# EAGLE design 2_RS485_RS422 (EAGLE 7.6.0)
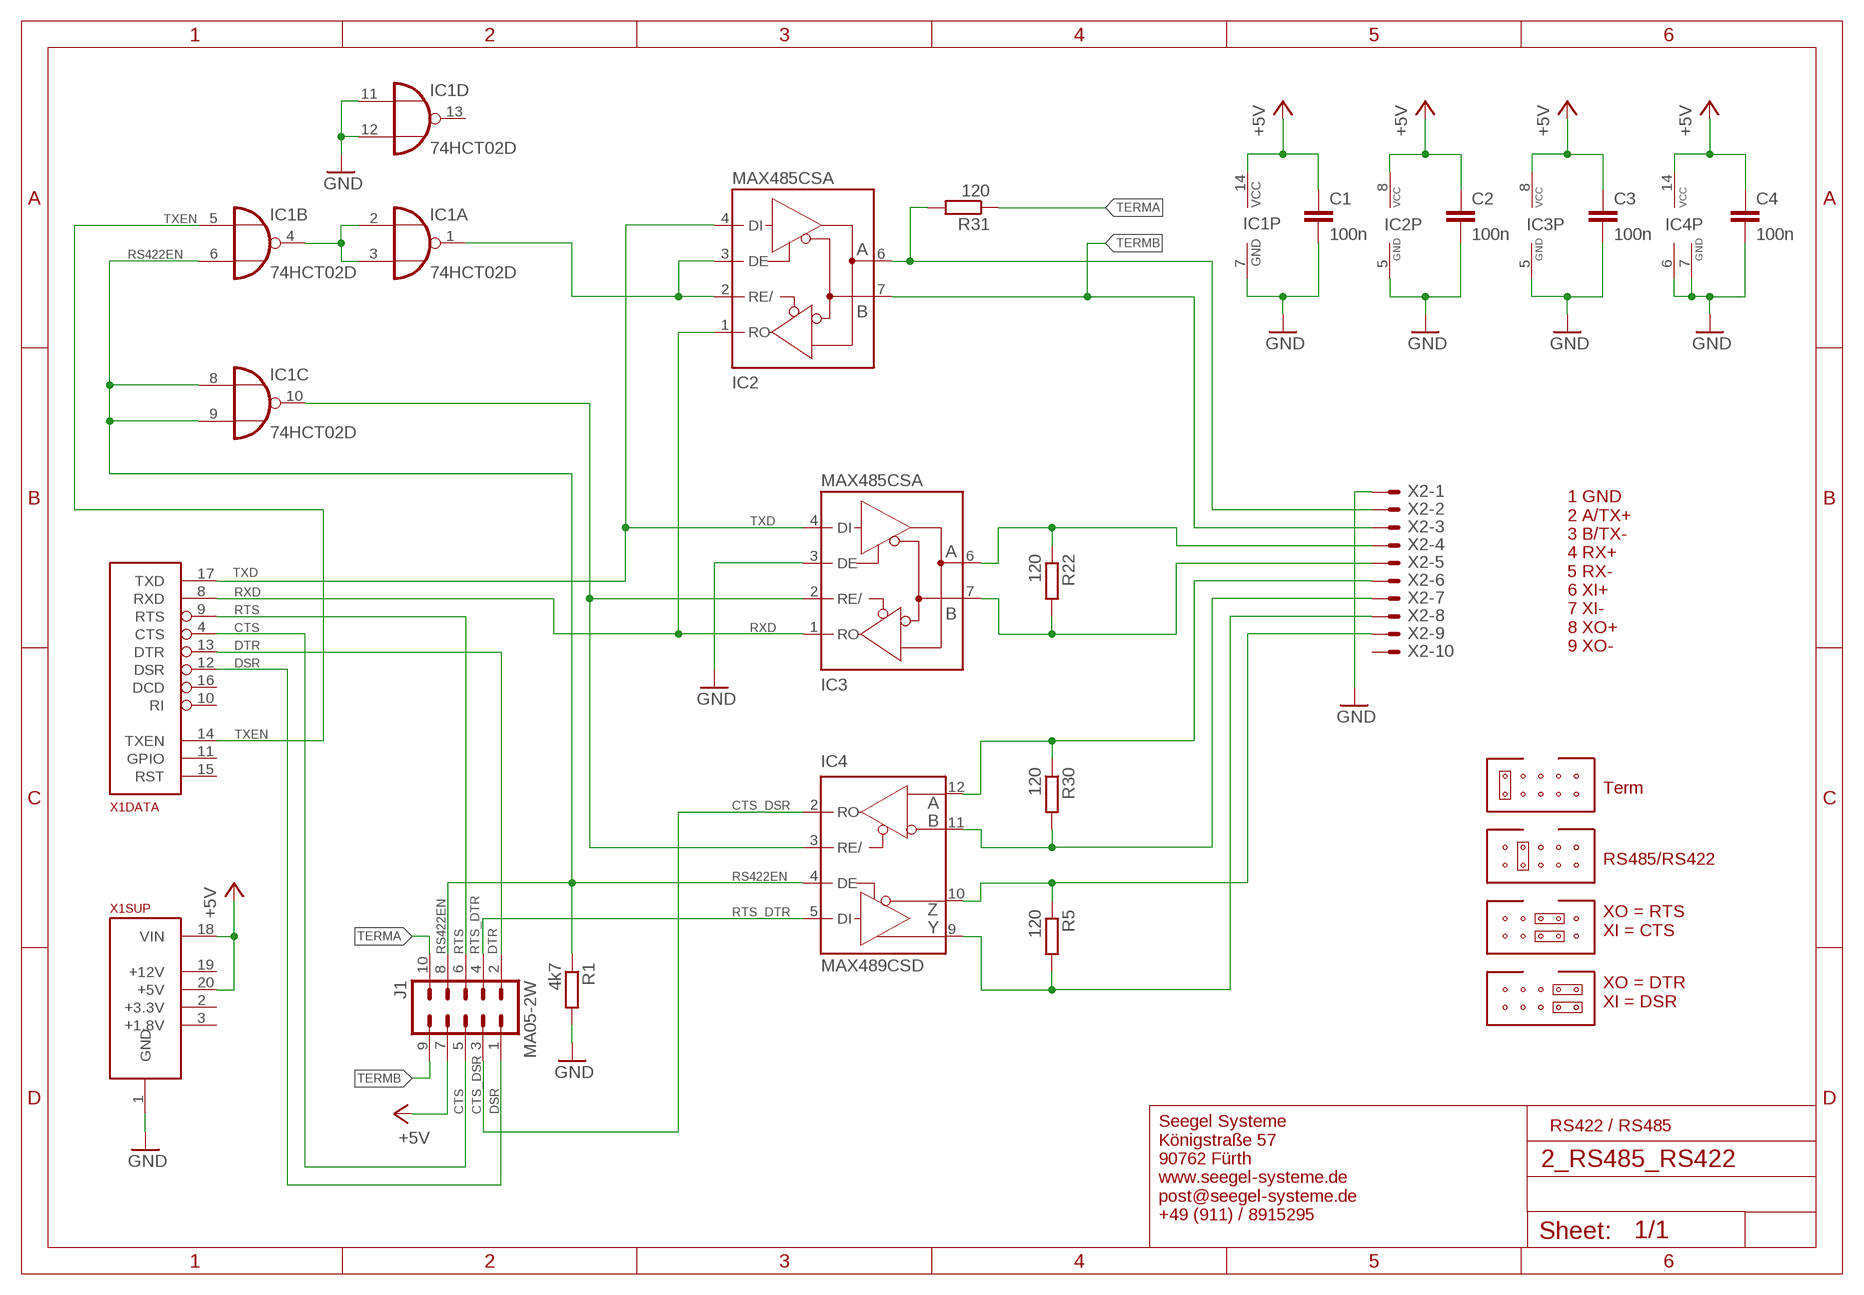
[diagram p0: schematic, sheet 1]

## Parts
C1  100n  C-EUC0805  [C0805]
C2  100n  C-EUC0805  [C0805]
C3  100n  C-EUC0805  [C0805]
C4  100n  C-EUC0805  [C0805]
IC1  74HCT02D  [SO14]
IC2  MAX485CSA  MAX481CSA  [SO08]
IC3  MAX485CSA  MAX481CSA  [SO08]
IC4  MAX489CSD  [SO14]
J1  MA05-2W  [MA05-2W]
R1  4k7  R-EU_R0805  [R0805]
R5  120  R-EU_R0805  [R0805]
R22  120  R-EU_R0805  [R0805]
R30  120  R-EU_R0805  [R0805]
R31  120  R-EU_R0805  [R0805]
X1  ALLSERIALSLAVE  [DAUGHTER-THT]
X2  AKL18X-10W  [AKL182-10]

## Nets
+5V: C1.1 C2.1 C3.1 C4.1 IC1.14(P:VCC) IC2.8(VCC) IC3.8(VCC) IC4.14(VCC) J1.7 X1.18(SUP:VIN) X1.20(SUP:+5V)
CTS: J1.5 X1.4(DATA:CTS)
CTS_DSR: IC4.2(RO) J1.3
DSR: J1.1 X1.12(DATA:DSR)
DTR: J1.2 X1.13(DATA:DTR)
GND: C1.2 C2.2 C3.2 C4.2 IC1.7(P:GND) IC1.11(D:I0) IC1.12(D:I1) IC2.5(GND) IC3.3(DE) IC3.5(GND) IC4.6(GND) IC4.7(GND) R1.2 X1.1(SUP:GND) X2.P$1
N$1: IC4.11(B) R30.2 X2.P$7
N$2: IC4.10(Z) R5.1 X2.P$9
N$3: IC2.6(A) R31.2 X2.P$2
N$10: IC4.9(Y) R5.2 X2.P$8
N$39: IC4.12(A) R30.1 X2.P$6
N$41: IC3.7(B) R22.2 X2.P$5
N$43: IC3.6(A) R22.1 X2.P$4
N$48: IC1.2(A:I0) IC1.3(A:I1) IC1.4(B:O)
N$50: IC1.1(A:O) IC2.2(RE/) IC2.3(DE)
N$51: IC1.10(C:O) IC3.2(RE/) IC4.3(RE/)
RS422EN: IC1.6(B:I1) IC1.8(C:I0) IC1.9(C:I1) IC4.4(DE) J1.8 R1.1
RTS: J1.6 X1.9(DATA:RTS)
RTS_DTR: IC4.5(DI) J1.4
RXD: IC2.1(RO) IC3.1(RO) X1.8(DATA:RXD)
TERMA: J1.10 R31.1
TERMB: IC2.7(B) J1.9 X2.P$3
TXD: IC2.4(DI) IC3.4(DI) X1.17(DATA:TXD)
TXEN: IC1.5(B:I0) X1.14(DATA:TXEN)
Unconnected: IC1.13(D:O) IC4.1(NC) IC4.8(NC) IC4.13(NC) X1.2(SUP:+3.3V) X1.3(SUP:+1.8V) X1.5(USB:D-) X1.6(USB:D+) X1.7(USB:VUSB) X1.10(DATA:RI) X1.11(DATA:GPIO) X1.15(DATA:RST) X1.16(DATA:DCD) X1.19(SUP:+12V) X2.P$10

## Notes on the sheet
- 1 GND
  2 A/TX+
  3 B/TX-
  4 RX+
  5 RX-
  6 XI+
  7 XI-
  8 XO+
  9 XO-
- Term
- RS485/RS422
- XO = RTS
  XI = CTS
- XO = DTR
  XI = DSR
- RS422 / RS485
- Seegel Systeme
  Königstraße 57
  90762 Fürth
  www.seegel-systeme.de
  post@seegel-systeme.de
  +49 (911) / 8915295

## Library data of the parts
C1-C4 = rcl:C-EU: CAPACITOR, European symbol
IC1 = 74xx-eu:74*02: Quad 2-input NOR gate
IC2 IC3 = maxim:MAX481CSA: RS485 TRANSEIVER; MF: MAXIM; MPN: MAX481CSA; OC_FARNELL: unknown; OC_NEWARK: 90C3817
IC4 = maxim:MAX489CSD: RS485 TRANSEIVER; MF: MAXIM; MPN: MAX489CSD; OC_FARNELL: 9724559; OC_NEWARK: 34C3923
J1 = con-lstb:MA05-2W
R1 R5 R22 R30 R31 = rcl:R-EU_: RESISTOR, European symbol
X1 = AllSerialv2:ALLSERIALSLAVE
X2 = con-riacon_akl:AKL18X-10: Riacon AKL18X Steckverbinder 10-Pol Grid = 3,5mm

## Board
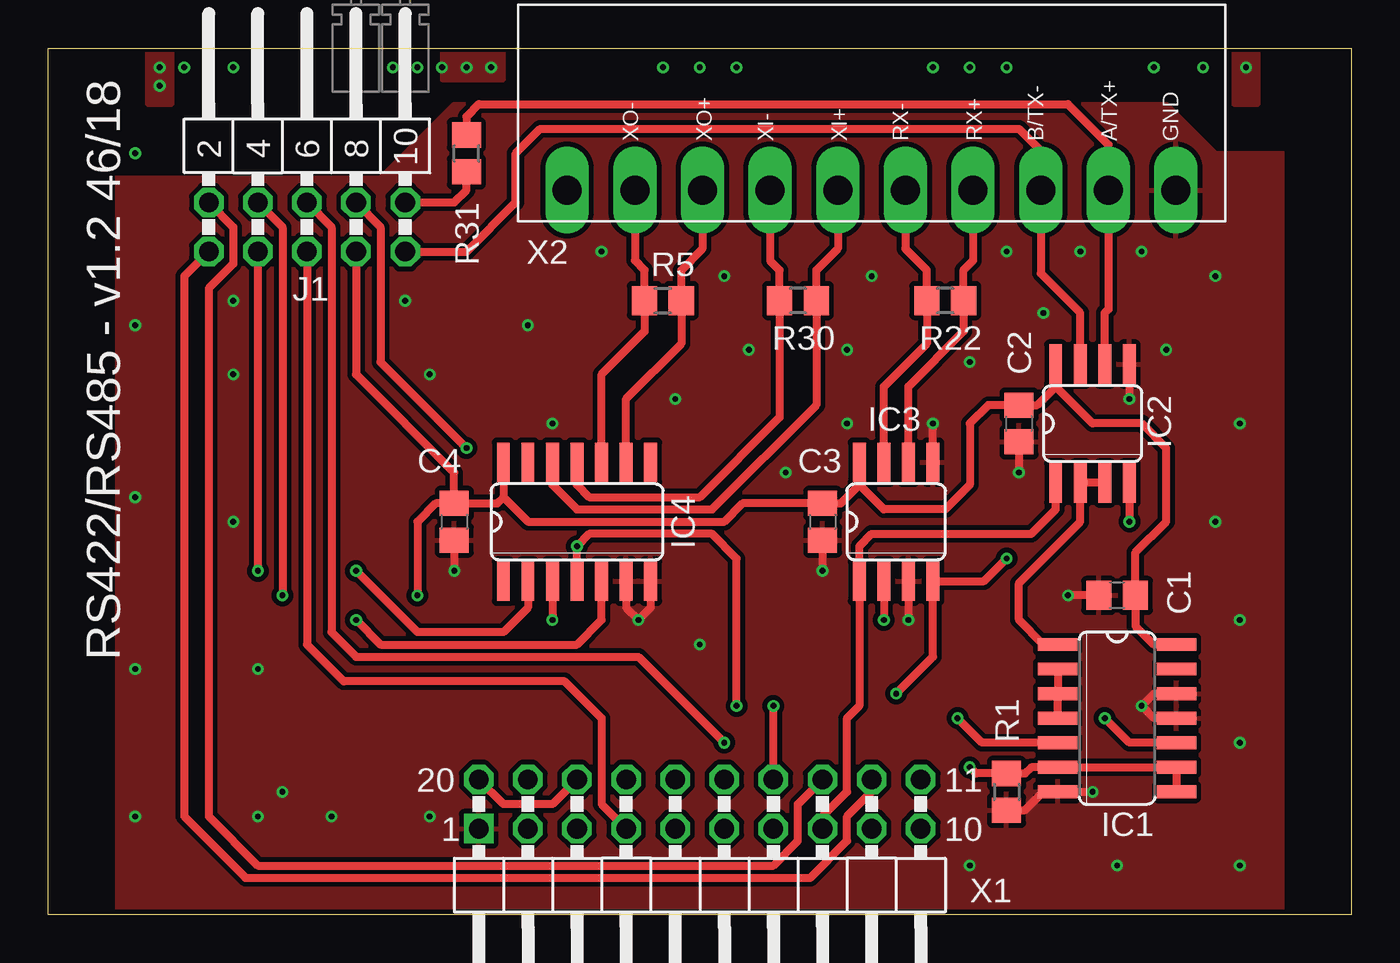
[diagram p1: board, top side]
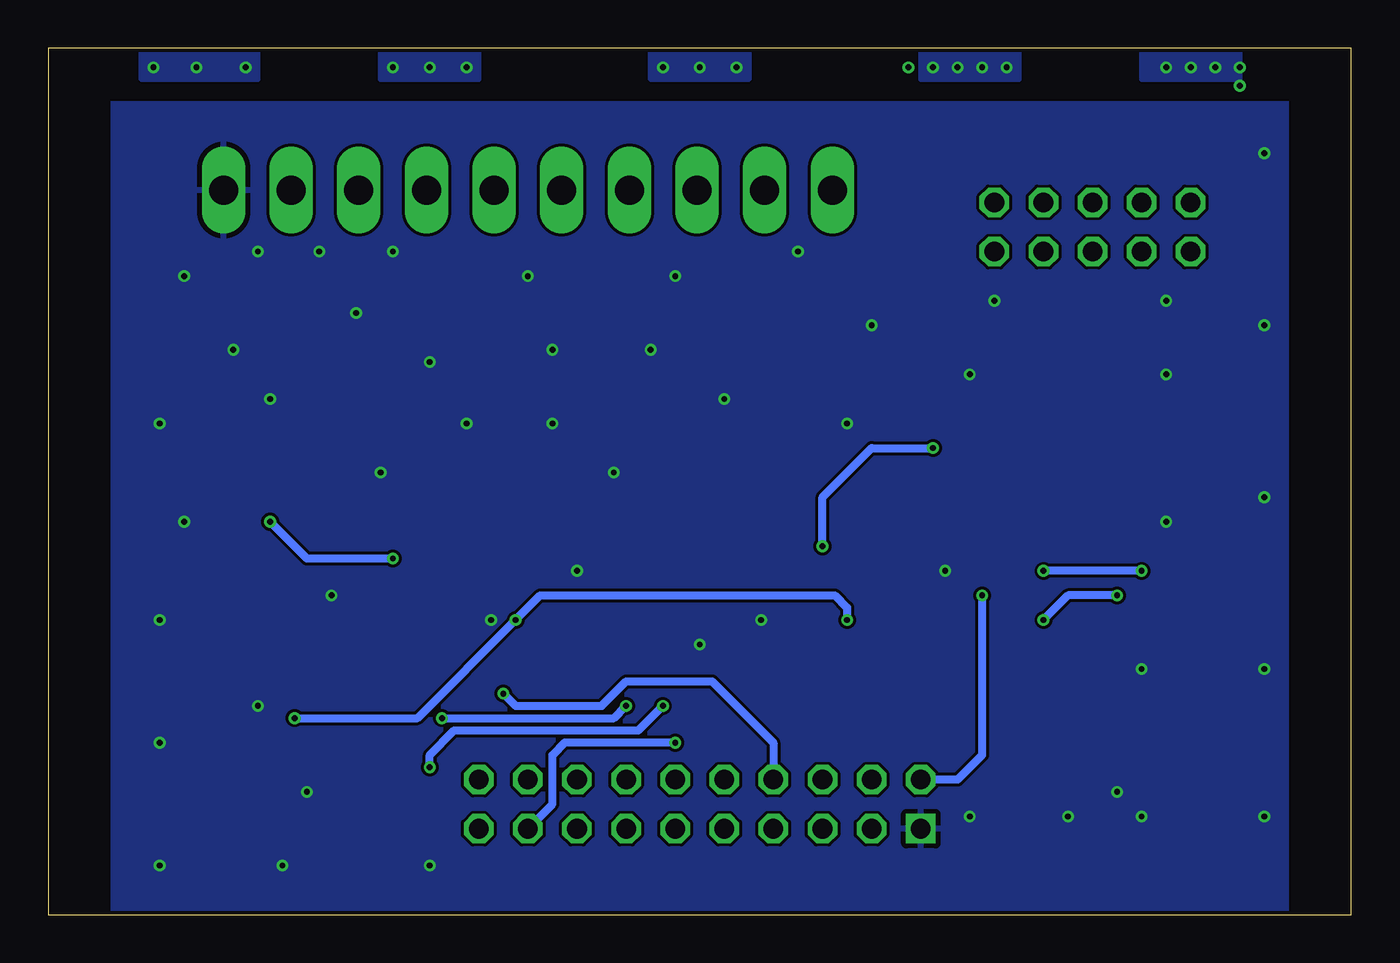
[diagram p2: board, bottom side, seen from below]

Size 67.4 x 44.8 mm. Coordinates in mm from the lower left corner, seen from the top.
Copper layers (1*16): Top 0.035mm / dielectric 1.6mm / Bottom 0.035mm
Design rules "Elecrow_2-layer_PCB_eagle_rule *": minimum track width 6mil, minimum drill 0.3mm, track to track 6mil, track to pad 6mil, pad to pad 6mil, via to via 8mil, smd to smd 0mil, copper to edge 0.2mm, drill to drill 10mil, minimum pad ring 6mil, minimum via ring 6mil, stop-mask expansion 0mil, vias tented up to drill 100mil, thermal gap 10mil

### Footprints (pad centres in the part's own frame; a part is rotated, then mirrored left to right if it is on the bottom)
C0805 = smd 1.3 x 1.5: 1 -0.95,0; 2 0.95,0
SO14 = smd 0.66 x 2.032: 1 -3.81,-3.073; 2 -2.54,-3.073; 3 -1.27,-3.073; 4 0,-3.073; 5 1.27,-3.073; 6 2.54,-3.073; 7 3.81,-3.073; 8 3.81,3.073; 9 2.54,3.073; 10 1.27,3.073; 11 0,3.073; 12 -1.27,3.073; 13 -2.54,3.073; 14 -3.81,3.073
SO08 = smd 0.66 x 2.032: 1 -1.905,-3.073; 2 -0.635,-3.073; 3 0.635,-3.073; 4 1.905,-3.073; 5 1.905,3.073; 6 0.635,3.073; 7 -0.635,3.073; 8 -1.905,3.073
MA05-2W = drill 1.016 octagon: 1 -5.08,-2.54; 2 -5.08,0; 3 -2.54,-2.54; 4 -2.54,0; 5 0,-2.54; 6 0,0; 7 2.54,-2.54; 8 2.54,0; 9 5.08,-2.54; 10 5.08,0
R0805 = smd 1.3 x 1.5: 1 -0.95,0; 2 0.95,0
DAUGHTER-THT = drill 1.016 square: 1 -11.43,4.445 | drill 1.016 octagon: 2 -8.89,4.445; 3 -6.35,4.445; 4 -3.81,4.445; 5 -1.27,4.445; 6 1.27,4.445; 7 3.81,4.445; 8 6.35,4.445; 9 8.89,4.445; 10 11.43,4.445; 11 11.43,6.985; 12 8.89,6.985; 13 6.35,6.985; 14 3.81,6.985; 15 1.27,6.985; 16 -1.27,6.985; 17 -3.81,6.985; 18 -6.35,6.985; 19 -8.89,6.985; 20 -11.43,6.985
AKL182-10 = drill 1.5 pad 2.184 long: P$1 -15.75,0; P$2 -12.25,0; P$3 -8.75,0; P$4 -5.25,0; P$5 -1.75,0; P$6 1.75,0; P$7 5.25,0; P$8 8.75,0; P$9 12.25,0; P$10 15.75,0

### Placement (x,y rotation side)
C1  55.29,16.51 180 top
C2  50.21,25.4 270 top
C3  40.05,20.32 270 top
C4  21,20.32 270 top
IC1  55.29,10.16 270 top
IC2  54.02,25.4 0 top
IC3  43.86,20.32 0 top
IC4  27.35,20.32 0 top
J1  13.38,36.83 0 top
R1  49.58,6.35 270 top
R5  31.8,31.75 0 top
R22  46.4,31.75 180 top
R30  38.78,31.75 180 top
R31  21.64,39.37 90 top
U$4  [JUMPER]  15.92,42.55 0 top
U$5  [JUMPER]  18.46,42.55 0 top
X1  33.7,0 0 top
X2  42.59,37.47 180 top

### Tracks (layer width: path | path; a pad name or v marks a point on that pad's centre or on a via)
+5V  (via drill 0.3)
  Top 0.406: IC2.8 52.12,27.3 | 52.12,27.3 51.16,26.35 C2.1 48.62,26.35 47.67,25.4 47.67,22.23 46.4,20.95 43.23,20.95 41.96,22.23 | IC3.8 41.96,22.23 | 41.96,22.23 41,21.27 C3.1 35.92,21.27 34.97,20.32 24.81,20.32 23.54,21.59 | C4.1 23.22,21.27 23.54,21.59 | IC4.14 23.54,21.59 | IC1.14 57.2,13.97 56.24,14.93 C1.1 56.24,18.73 57.83,20.32 57.83,24.13 56.56,25.4 54.02,25.4 52.12,27.3 | J1.7 15.92,27.94 21,22.86 C4.1 | X1.18 26.08,5.71 23.54,5.71 X1.20 | v19.1,16.51 19.1,20.32 20.05,21.27 C4.1
  Bottom 0.406: v19.1,16.51 19.1,8.26 20.37,6.99 X1.20
CTS
  Top 0.406: J1.5 13.38,13.97 15.29,12.06 26.72,12.06 28.62,10.16 28.62,5.71 X1.4
CTS_DSR  (via drill 0.3)
  Top 0.406: J1.3 v10.84,17.78 | IC4.2 24.81,15.88 23.54,14.61 19.1,14.61 v15.92,17.78
  Bottom 0.406: v10.84,17.78 v15.92,17.78
DSR
  Top 0.406: J1.1 7.03,33.02 7.03,5.08 10.21,1.91 39.42,1.91 41.32,3.81 41.32,5.08 42.59,6.35 X1.12
DTR
  Top 0.406: J1.2 9.57,35.56 9.57,33.66 8.3,32.38 8.3,5.08 10.84,2.54 37.51,2.54 38.78,3.81 38.78,5.71 X1.13
GND  (via drill 0.3)
  Top 0.406: IC2.5 v55.93,26.67 | C2.2 v50.21,22.86 | IC3.5 v45.77,25.4 | IC3.3 v44.5,15.24 | C3.2 v40.05,17.78 | v54.02,6.35 IC1.7 51.48,6.35 50.53,5.4 R1.2 | IC1.11 57.2,10.16 v56.56,10.79 57.2,11.43 IC1.12 | C1.2 v52.75,16.51 | C4.2 v21,17.78 | IC4.6 29.89,15.88 v30.53,15.24 31.16,15.88 IC4.7
  other vias: 19.73,5.08 10.84,5.08 12.11,6.35 14.65,5.08 4.49,5.08 4.49,12.7 4.49,21.59 4.49,30.48 4.49,39.37 9.57,31.75 9.57,27.94 9.57,20.32 10.84,12.7 33.7,13.97 18.46,31.75 19.73,27.94 26.08,25.4 28.62,34.29 24.81,30.48 34.97,33.02 36.24,29.21 32.43,26.67 42.59,33.02 41.32,29.21 41.32,25.4 38.15,22.86 49.58,34.29 51.48,31.11 47.67,28.57 53.39,34.29 56.56,34.29 60.37,33.02 57.83,29.21 61.64,25.4 60.37,20.32 61.64,15.24 61.64,8.89 61.64,2.54 55.29,2.54 47.67,2.54
  pour Bottom: -0.59,41.91 67.99,41.91 67.99,0 -0.59,0
  pour Top (isolate 0.254): 3.22,0 3.22,38.1 17.19,38.1 21,41.91 57.83,41.91 60.37,39.37 67.99,39.37 67.99,0
N$1
  Top 0.406: X2.P$7 37.34,33.83 37.83,33.34 R30.2 37.83,25.72 33.7,21.59 27.99,21.59 27.35,22.23 IC4.11
N$2
  Top 0.406: X2.P$9 30.34,33.84 30.85,33.34 R5.1 30.85,30.16 28.62,27.94 IC4.10
N$3
  Top 0.406: R31.2 21.64,41.27 22.27,41.91 52.75,41.91 54.84,39.82 X2.P$2 54.84,31.3 54.66,31.11 IC2.6
N$4  (via drill 0.3)
  other vias: 5.76,43.81 5.76,42.86 7.03,43.81 8.3,43.81 9.57,43.81
  pour Top: 5.13,45.09 5.13,41.91 6.4,41.91 6.4,45.09
  pour Bottom: 5.76,45.09 5.76,43.18 10.84,43.18 10.84,45.09
N$5  (via drill 0.3)
  other vias: 17.83,43.81 22.91,43.81 19.1,43.81 20.37,43.81 21.64,43.81
  pour Top: 20.37,45.09 20.37,43.18 23.54,43.18 23.54,45.09
  pour Bottom: 17.19,45.09 17.19,43.18 22.27,43.18 22.27,45.09
N$7  (via drill 0.3)
  other vias: 33.7,43.81 31.8,43.81 35.61,43.81
  pour Bottom: 31.16,45.09 31.16,43.18 36.24,43.18 36.24,45.09
N$8  (via drill 0.3)
  other vias: 47.67,43.81 45.77,43.81 49.58,43.81
  pour Bottom: 45.13,45.09 45.13,43.18 50.21,43.18 50.21,45.09
N$9  (via drill 0.3)
  other vias: 59.73,43.81 57.2,43.81 61.96,43.81
  pour Bottom: 56.56,45.09 56.56,43.18 62.59,43.18 62.59,45.09
  pour Top: 61.32,45.09 61.32,41.91 62.59,41.91 62.59,45.09
N$10
  Top 0.406: X2.P$8 33.84,34.43 32.75,33.34 R5.2 32.75,29.52 29.89,26.67 IC4.9
N$39
  Top 0.406: X2.P$6 40.84,34.45 39.73,33.34 R30.1 39.73,26.35 34.34,20.95 27.35,20.95 26.08,22.23 IC4.12
N$41
  Top 0.406: X2.P$5 44.34,34.45 45.45,33.34 R22.2 45.45,29.53 43.23,27.3 IC3.7
N$43
  Top 0.406: X2.P$4 47.84,33.83 47.35,33.34 R22.1 47.35,30.16 44.5,27.3 IC3.6
N$48
  Top 0.406: IC1.2 IC1.3 IC1.4
N$50
  Top 0.406: IC1.1 51.48,13.97 50.21,15.24 50.21,17.14 53.39,20.32 IC2.2 IC2.3
N$51  (via drill 0.3)
  Top 0.406: IC4.3 v26.08,15.24 | IC3.2 v43.23,15.24 | IC1.10 55.93,8.89 v54.66,10.16
  Bottom 0.406: v26.08,15.24 26.08,15.88 26.72,16.51 41.96,16.51 v43.23,15.24 48.31,10.16 v54.66,10.16
RS422EN  (via drill 0.3)
  Top 0.406: IC1.8 IC1.9 IC1.6 50.84,7.62 50.53,7.3 R1.1 47.99,7.3 v47.67,7.62 | J1.8 17.19,35.56 17.19,28.57 v21.64,24.13 | IC4.4 v27.35,19.05 27.99,19.68 34.34,19.68 35.61,18.41 v35.61,10.79
  Bottom 0.406: v27.35,19.05 27.35,21.59 24.81,24.13 v21.64,24.13 | v47.67,7.62 47.67,8.26 46.4,9.53 36.88,9.53 v35.61,10.79
RTS  (via drill 0.3)
  Top 0.406: J1.6 14.65,35.56 14.65,14.61 15.92,13.34 30.53,13.34 v34.97,8.89
  Bottom 0.406: v34.97,8.89 40.69,8.89 41.32,8.26 41.32,5.71 X1.9
RTS_DTR  (via drill 0.3)
  Top 0.406: J1.4 12.11,35.56 v12.11,16.51 | v15.92,15.24 17.19,13.97 27.35,13.97 28.62,15.24 IC4.5
  Bottom 0.406: v12.11,16.51 14.65,16.51 v15.92,15.24
RXD
  Top 0.406: IC2.1 52.12,20.95 50.84,19.68 42.59,19.68 41.96,19.05 IC3.1 41.96,10.79 41.32,10.16 41.32,6.35 40.05,5.08 X1.8
TERMA
  Top 0.406: J1.10 21,36.83 21.64,37.47 R31.1
TERMB
  Top 0.305: 51.48,36.97 X2.P$3
  Top 0.406: J1.9 21.64,34.29 24.18,36.83 24.18,39.37 25.45,40.64 50.21,40.64 51.48,39.37 51.48,36.97 | IC2.7 53.39,31.11 51.34,33.16 X2.P$3
TXD  (via drill 0.3)
  Top 0.406: v43.86,11.43 45.77,13.34 IC3.4 48.41,17.25 v49.58,18.41 | IC2.4 v55.93,20.32
  Bottom 0.406: v49.58,18.41 54.02,18.41 v55.93,20.32 | v43.86,11.43 43.23,10.79 38.78,10.79 37.51,12.06 33.07,12.06 29.89,8.89 X1.17
TXEN  (via drill 0.3)
  Top 0.406: IC1.5 48.31,8.89 v47.04,10.16 | X1.14 v37.51,10.79
  Bottom 0.406: v47.04,10.16 38.15,10.16 v37.51,10.79

### Text on the board
tPlace: RS422/RS485 - v1.2 46/18 | XO- | XO+ | XI- | XI+ | RX- | RX+ | B/TX- | A/TX+ | GND